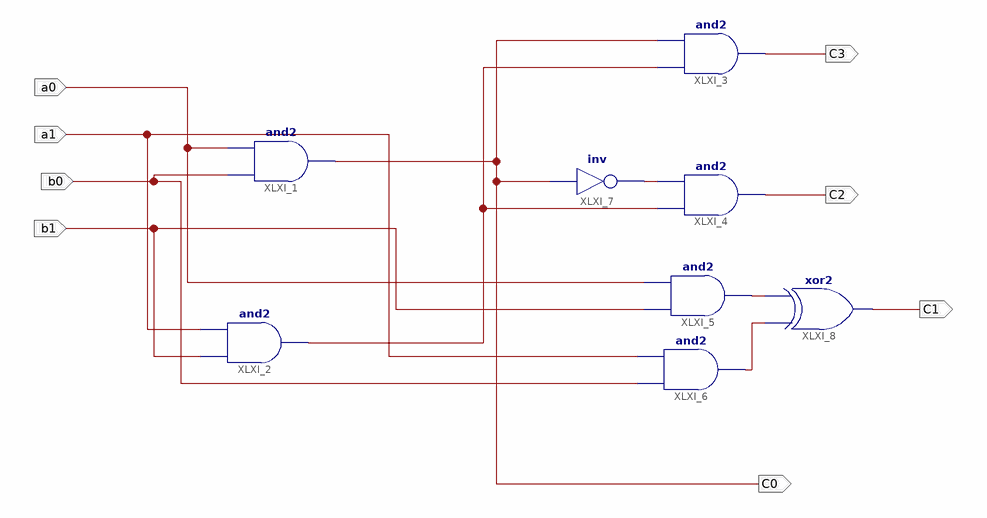
[diagram p0: schematic sheet 1]
// Xilinx ISE schematic mut_1.sch (spartan3) as structural Verilog: 8 symbols, 8 ports
module mut_1 (
  input  a0,
  input  a1,
  input  b0,
  input  b1,
  output C0,
  output C3,
  output C2,
  output C1
);

  wire XLXN_1, XLXN_11, XLXN_12, XLXN_13;

  and XLXI_1 (C0, b0, a0);
  and XLXI_2 (XLXN_11, b1, a1);
  and XLXI_3 (C3, XLXN_11, C0);
  and XLXI_4 (C2, XLXN_11, XLXN_1);
  and XLXI_5 (XLXN_12, b1, a0);
  and XLXI_6 (XLXN_13, b0, a1);
  not XLXI_7 (XLXN_1, C0);
  xor XLXI_8 (C1, XLXN_13, XLXN_12);
endmodule
